# Altium schematic sheet WIRELESS.SchDoc
size A4; SheetNumber: 7; SheetTotal: 7
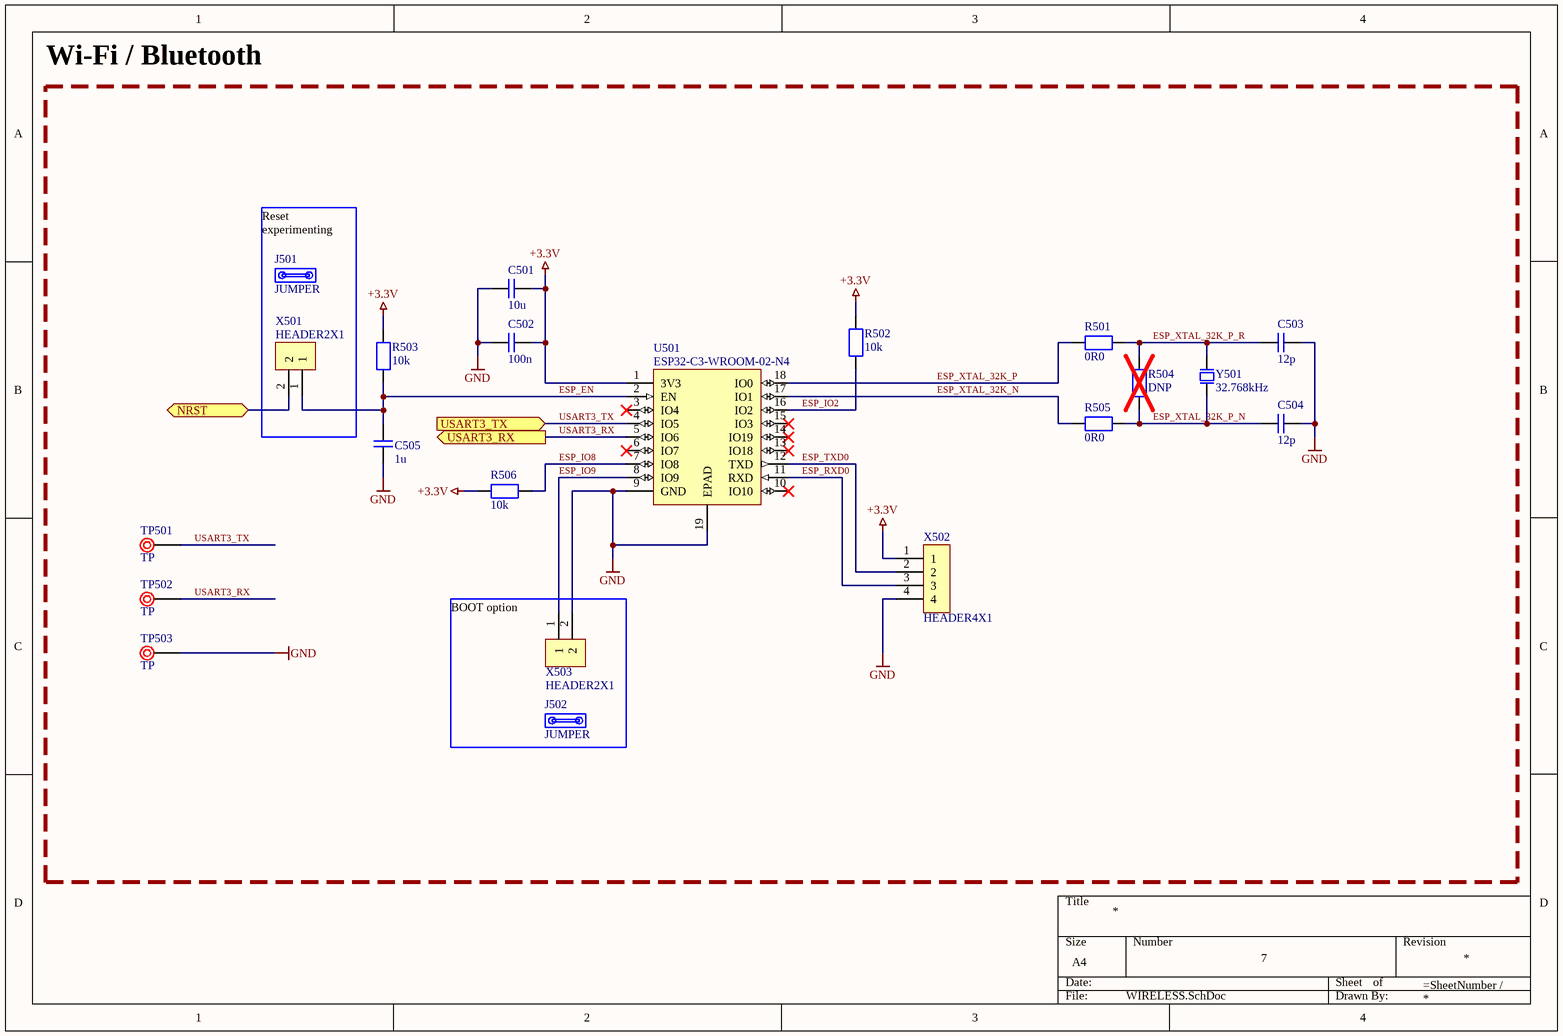
[diagram p0: WIRELESS.SchDoc]

## Parts
C501  10u  [CAPC0603]
C502  100n  [CAPC0603]
C503  12p  [CAPC0603]
C504  12p  [CAPC0603]
C505  1u  [CAPC0603]
J501  JUMPER  (mechanical)
J502  JUMPER  (mechanical)
R501  0R0  [RESC0603]
R502  10k  [RESC0603]
R503  10k  [RESC0603]
R504  DNP  [RESC0603]
R505  0R0  [RESC0603]
R506  10k  [RESC0603]
TP501  TP  [TESTPOINT]
TP502  TP  [TESTPOINT]
TP503  TP  [TESTPOINT]
U501  ESP32-C3-WROOM-02-N4  [ESP32-C3-WROOM-02-N4]
X501  HEADER2X1  [HDRV2W64P254_2X1_508X254X1150]
X502  HEADER4X1  [HDRV4W64P254_4X1_1016X254X1150]
X503  HEADER2X1  [HDRV2W64P254_2X1_508X254X1150]
Y501  32.768kHz  [XTAL320X150X80]

## Blocks framed on the sheet
Wi-Fi / Bluetooth: C501-C505 J501 J502 R501-R506 TP501-TP503 U501 X501-X503 Y501

## Ports
NRST (bidir, see CONN[4A], MCU[2D]), USART3_RX (out, see MCU[1C]), USART3_TX (in, see MCU[1C])

## Nets
+3.3V: C501.1 C502.1 R502.2 R503.2 R506.2 U501.1(3V3) X502.1
GND: C501.2 C502.2 C503.1 C504.1 C505.1 TP503.1 U501.9(GND) U501.19(EPAD) X502.4 X503.2
ESP_EN: C505.2 R503.1 U501.2(EN) X501.1
ESP_IO2: R502.1 U501.16(IO2)
ESP_IO8: R506.1 U501.7(IO8)
ESP_IO9: U501.8(IO9) X503.1
ESP_RXD0: U501.11(RXD) X502.3
ESP_TXD0: U501.12(TXD) X502.2
ESP_XTAL_32K_N: R505.2 U501.17(IO1)
ESP_XTAL_32K_P: R501.2 U501.18(IO0)
ESP_XTAL_32K_P_N: C504.2 R504.2 R505.1 Y501.1
ESP_XTAL_32K_P_R: C503.2 R501.1 R504.1 Y501.2
NRST: X501.2 ; port NRST
USART3_RX: TP502.1 U501.5(IO6) ; port USART3_RX
USART3_TX: TP501.1 U501.4(IO5) ; port USART3_TX

Not connected (* = marked no-connect by the designer): U501 3(IO4)* 6(IO7)* 10(IO10)* 13(IO18)* 14(IO19)* 15(IO3)*

## Notes on the sheet
- Reset experimenting
- BOOT option

## Library data of the parts
C501-C505 = CAPC0603: Ceramic capacitor, VAL?,  VOL?, DIEL?; Checked: Yes; MFR: ?; Supplier: Digi-Key; SPN: ?; MFRN: ?; LCSC Part Number: ?
  C501: Value: 10u
  C502: Value: 100n
  C503 C504: Footprint: 0603; Value: 12p
  C505: Value: 1u
J501 J502 = JUMPER: Open Top 3A 2.54mm P=2.54mm Shunts & Jumpers ROHS; MFR: Kycon, Inc.; MFRN: SX1100-A; SPN: 2092-SX1100-A-ND; Value: C5305; Checked: Yes; Supplier: Digi-Key; LCSC Part Number: C5305
R501-R506 = RES0603: Thick film resistor, VAL?, POW?; Checked: Yes; MFR: ?; Supplier: Digi-Key; SPN: ?; MFRN: ?; LCSC Part Number: ?
  R501 R505: Value: 0R0
  R502 R503 R506: Value: 10k
  R504: Value: DNP
TP501-TP503 = TESTPOINT: MFR: Keystone; MFRN: 5001; SPN: 36-5001-ND; Value: 5001; Checked: Yes; Supplier: Digi-Key; LCSC Part Number: C238122
U501 = ESP32-C3-WROOM-02-N4: RF transceiver module, Bluetooth, WiFi; MFR: Espressif Systems; SPN: 1965-ESP32-C3-WROOM-02-N4TR-ND; Checked: Yes; Supplier: Digi-Key; MFRN: ESP32-C3-WROOM-02-N4; Value: ESP32-C3-WROOM-02-N4; LCSC Part Number: C2934560
X501 X503 = HEADER2X1: Pin Header 2x1, P2.54; MFR: Adam Tech; MFRN: PH1-02-UA; SPN: 2057-PH1-02-UA-ND; Checked: Yes; Supplier: Digi-Key; Value: HEADER2X1; LCSC Part Number: C2883961
X502 = HEADER4X1: Pin Header 4x1, P2.54; MFR: Würth Elektronik; MFRN: 61300411121; SPN: 732-5317-ND; Checked: Yes; Supplier: Digi-Key; Value: HEADER4X1
Y501 = X1A0001410002: Crystal, 32.768Hz, 9pF, 50kOhms; MFR: Seiko Epson; SPN: SER4072TR-ND; Checked: Yes; Footprint: SMD3215-2P; Supplier: Digi-Key; MFRN: X1A0001410002; Value: 32.768kHz; LCSC Part Number: C1987155